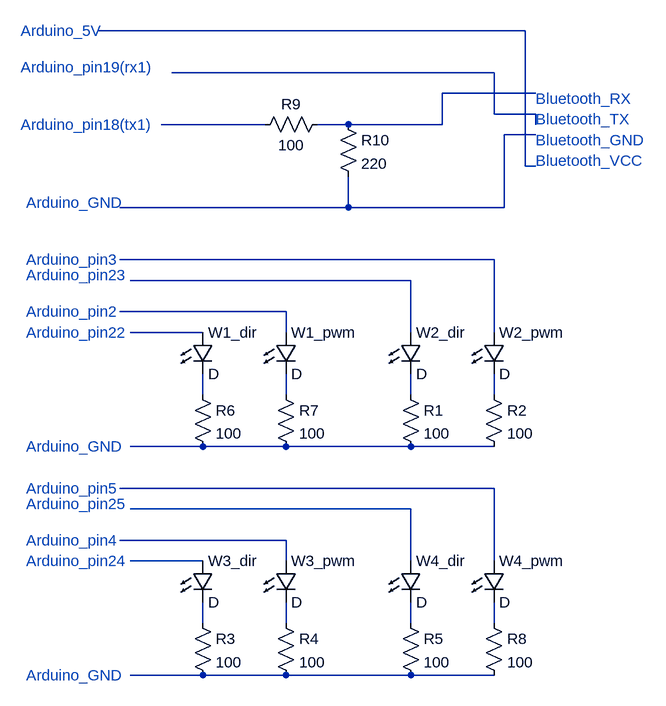
[diagram p0: schematic frogArduino.asc]
frogArduino.asc, the LTspice schematic file:
Version 4
SHEET 1 880 680
WIRE 384 -608 -272 -608
WIRE 336 -544 -160 -544
WIRE 400 -512 256 -512
WIRE 336 -480 336 -544
WIRE 400 -480 336 -480
WIRE -16 -464 -176 -464
WIRE 112 -464 64 -464
WIRE 256 -464 256 -512
WIRE 256 -464 112 -464
WIRE 400 -464 400 -480
WIRE 400 -448 352 -448
WIRE 384 -400 384 -608
WIRE 400 -400 384 -400
WIRE 112 -336 112 -384
WIRE 112 -336 -240 -336
WIRE 352 -336 352 -448
WIRE 352 -336 112 -336
WIRE 336 -256 -240 -256
WIRE 208 -224 -224 -224
WIRE 16 -176 -240 -176
WIRE -112 -144 -224 -144
WIRE 16 -144 16 -176
WIRE 208 -144 208 -224
WIRE 336 -144 336 -256
WIRE -112 -48 -112 -80
WIRE 16 -48 16 -80
WIRE 208 -48 208 -80
WIRE 336 -48 336 -80
WIRE -112 32 -224 32
WIRE 16 32 -112 32
WIRE 208 32 16 32
WIRE 336 32 208 32
WIRE 336 96 -240 96
WIRE 208 128 -224 128
WIRE 16 176 -240 176
WIRE -112 208 -224 208
WIRE 16 208 16 176
WIRE 208 208 208 128
WIRE 336 208 336 96
WIRE -112 304 -112 272
WIRE 16 304 16 272
WIRE 208 304 208 272
WIRE 336 304 336 272
WIRE -112 384 -224 384
WIRE 16 384 -112 384
WIRE 208 384 16 384
WIRE 336 384 208 384
SYMBOL LED -128 -144 R0
SYMATTR InstName W1_dir
SYMBOL LED 0 -144 R0
SYMATTR InstName W1_pwm
SYMBOL res -128 -64 R0
SYMATTR InstName R6
SYMATTR Value 100
SYMBOL res 0 -64 R0
SYMATTR InstName R7
SYMATTR Value 100
SYMBOL LED 192 -144 R0
SYMATTR InstName W2_dir
SYMBOL LED 320 -144 R0
SYMATTR InstName W2_pwm
SYMBOL res 192 -64 R0
SYMATTR InstName R1
SYMATTR Value 100
SYMBOL res 320 -64 R0
SYMATTR InstName R2
SYMATTR Value 100
SYMBOL LED -128 208 R0
SYMATTR InstName W3_dir
SYMBOL LED 0 208 R0
SYMATTR InstName W3_pwm
SYMBOL res -128 288 R0
SYMATTR InstName R3
SYMATTR Value 100
SYMBOL res 0 288 R0
SYMATTR InstName R4
SYMATTR Value 100
SYMBOL LED 192 208 R0
SYMATTR InstName W4_dir
SYMBOL LED 320 208 R0
SYMATTR InstName W4_pwm
SYMBOL res 192 288 R0
SYMATTR InstName R5
SYMATTR Value 100
SYMBOL res 320 288 R0
SYMATTR InstName R8
SYMATTR Value 100
SYMBOL res 80 -480 R90
WINDOW 0 0 56 VBottom 2
WINDOW 3 32 56 VTop 2
SYMATTR InstName R9
SYMATTR Value 100
SYMBOL res 96 -480 R0
SYMATTR InstName R10
SYMATTR Value 220
TEXT -384 -176 Left 2 ;Arduino_pin2
TEXT -384 -144 Left 2 ;Arduino_pin22
TEXT -384 -256 Left 2 ;Arduino_pin3
TEXT -384 -232 Left 2 ;Arduino_pin23
TEXT -384 176 Left 2 ;Arduino_pin4
TEXT -384 208 Left 2 ;Arduino_pin24
TEXT -384 96 Left 2 ;Arduino_pin5
TEXT -384 120 Left 2 ;Arduino_pin25
TEXT -392 -552 Left 2 ;Arduino_pin19(rx1)
TEXT -392 -464 Left 2 ;Arduino_pin18(tx1)
TEXT 400 -504 Left 2 ;Bluetooth_RX
TEXT 400 -472 Left 2 ;Bluetooth_TX
TEXT 400 -440 Left 2 ;Bluetooth_GND
TEXT 400 -408 Left 2 ;Bluetooth_VCC
TEXT -384 -344 Left 2 ;Arduino_GND
TEXT -392 -608 Left 2 ;Arduino_5V
TEXT -384 32 Left 2 ;Arduino_GND
TEXT -384 384 Left 2 ;Arduino_GND

The netlist it stands for:
* frogArduino.asc
D§W1_dir N009 N010 D
D§W1_pwm N008 N011 D
R6 N010 N014 100
R7 N011 N014 100
D§W2_dir N007 N012 D
D§W2_pwm N006 N013 D
R1 N012 N014 100
R2 N013 N014 100
D§W3_dir N018 N019 D
D§W3_pwm N017 N020 D
R3 N019 N023 100
R4 N020 N023 100
D§W4_dir N016 N021 D
D§W4_pwm N015 N022 D
R5 N021 N023 100
R8 N022 N023 100
R9 N003 N004 100
R10 N003 N005 220
.model D D
.lib standard.dio
* Arduino_pin2
* Arduino_pin22
* Arduino_pin3
* Arduino_pin23
* Arduino_pin4
* Arduino_pin24
* Arduino_pin5
* Arduino_pin25
* Arduino_pin19(rx1)
* Arduino_pin18(tx1)
* Bluetooth_RX
* Bluetooth_TX
* Bluetooth_GND
* Bluetooth_VCC
* Arduino_GND
* Arduino_5V
* Arduino_GND
* Arduino_GND
.backanno
.end